# EAGLE board eightbyeight-ICN2012 (EAGLE 7.6.0)
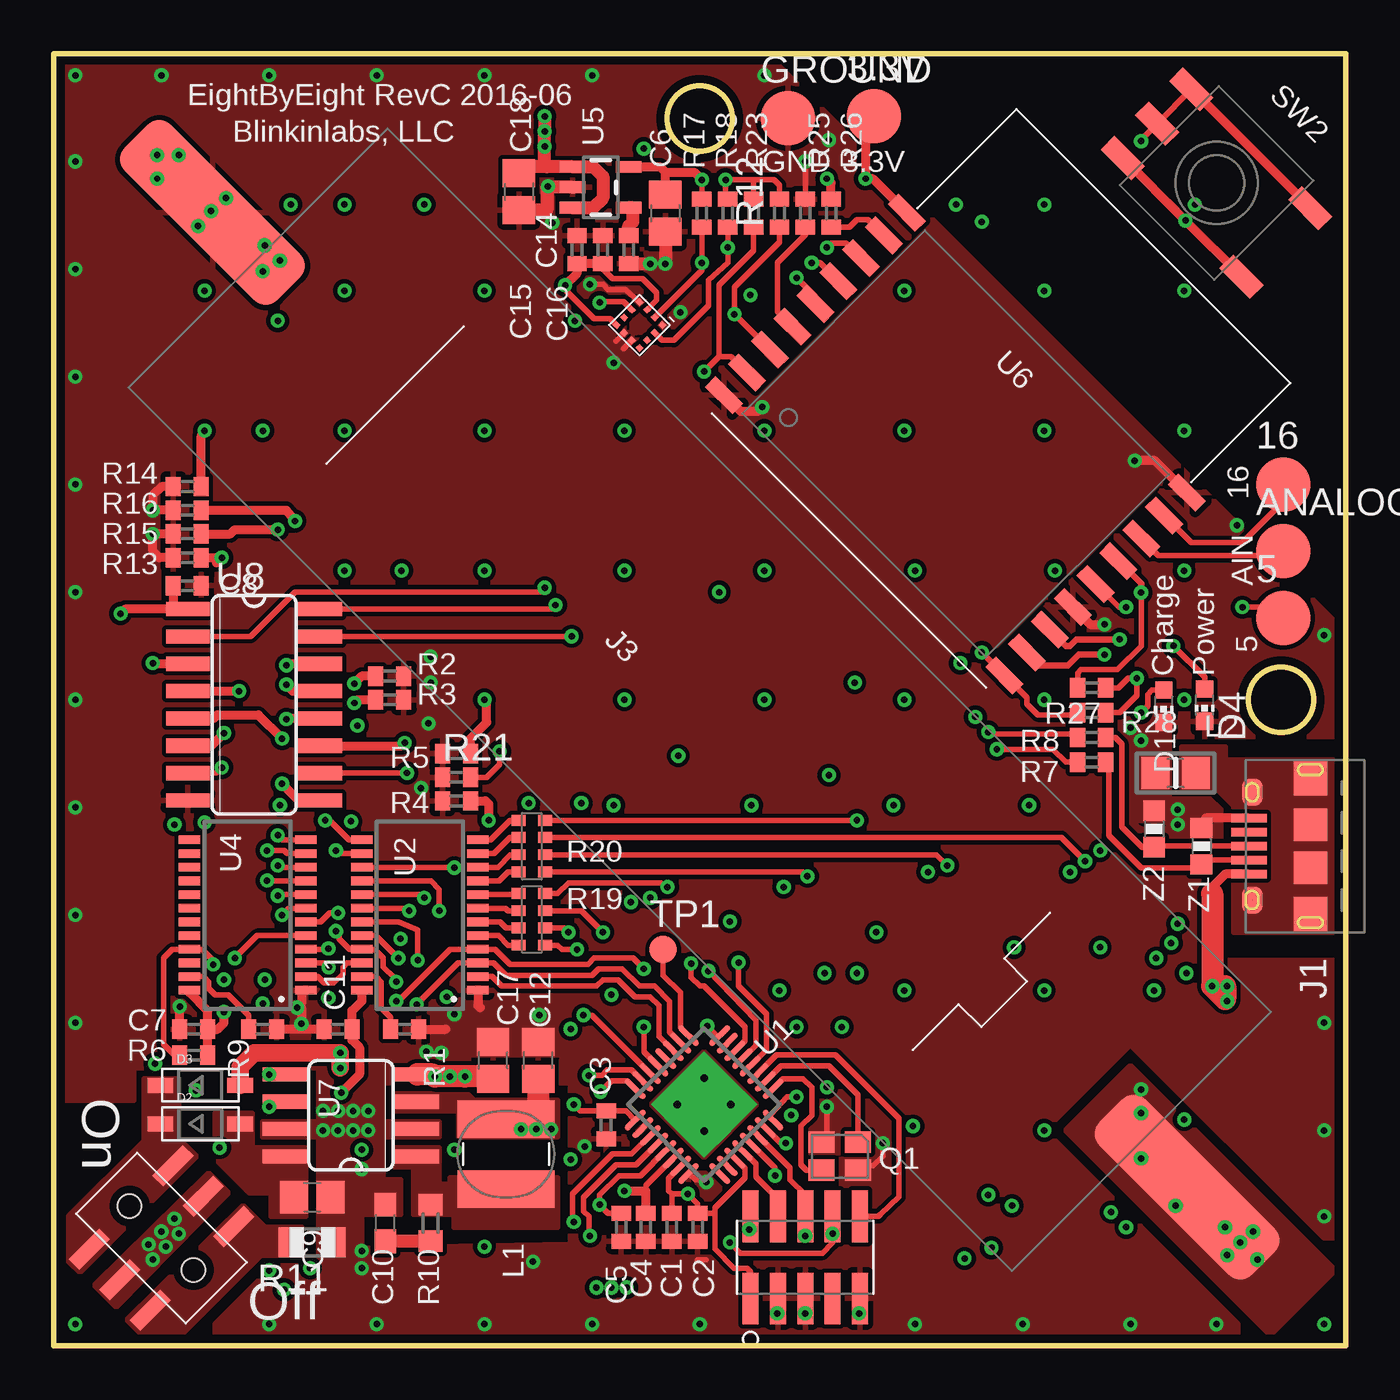
[diagram p6: board, top side]
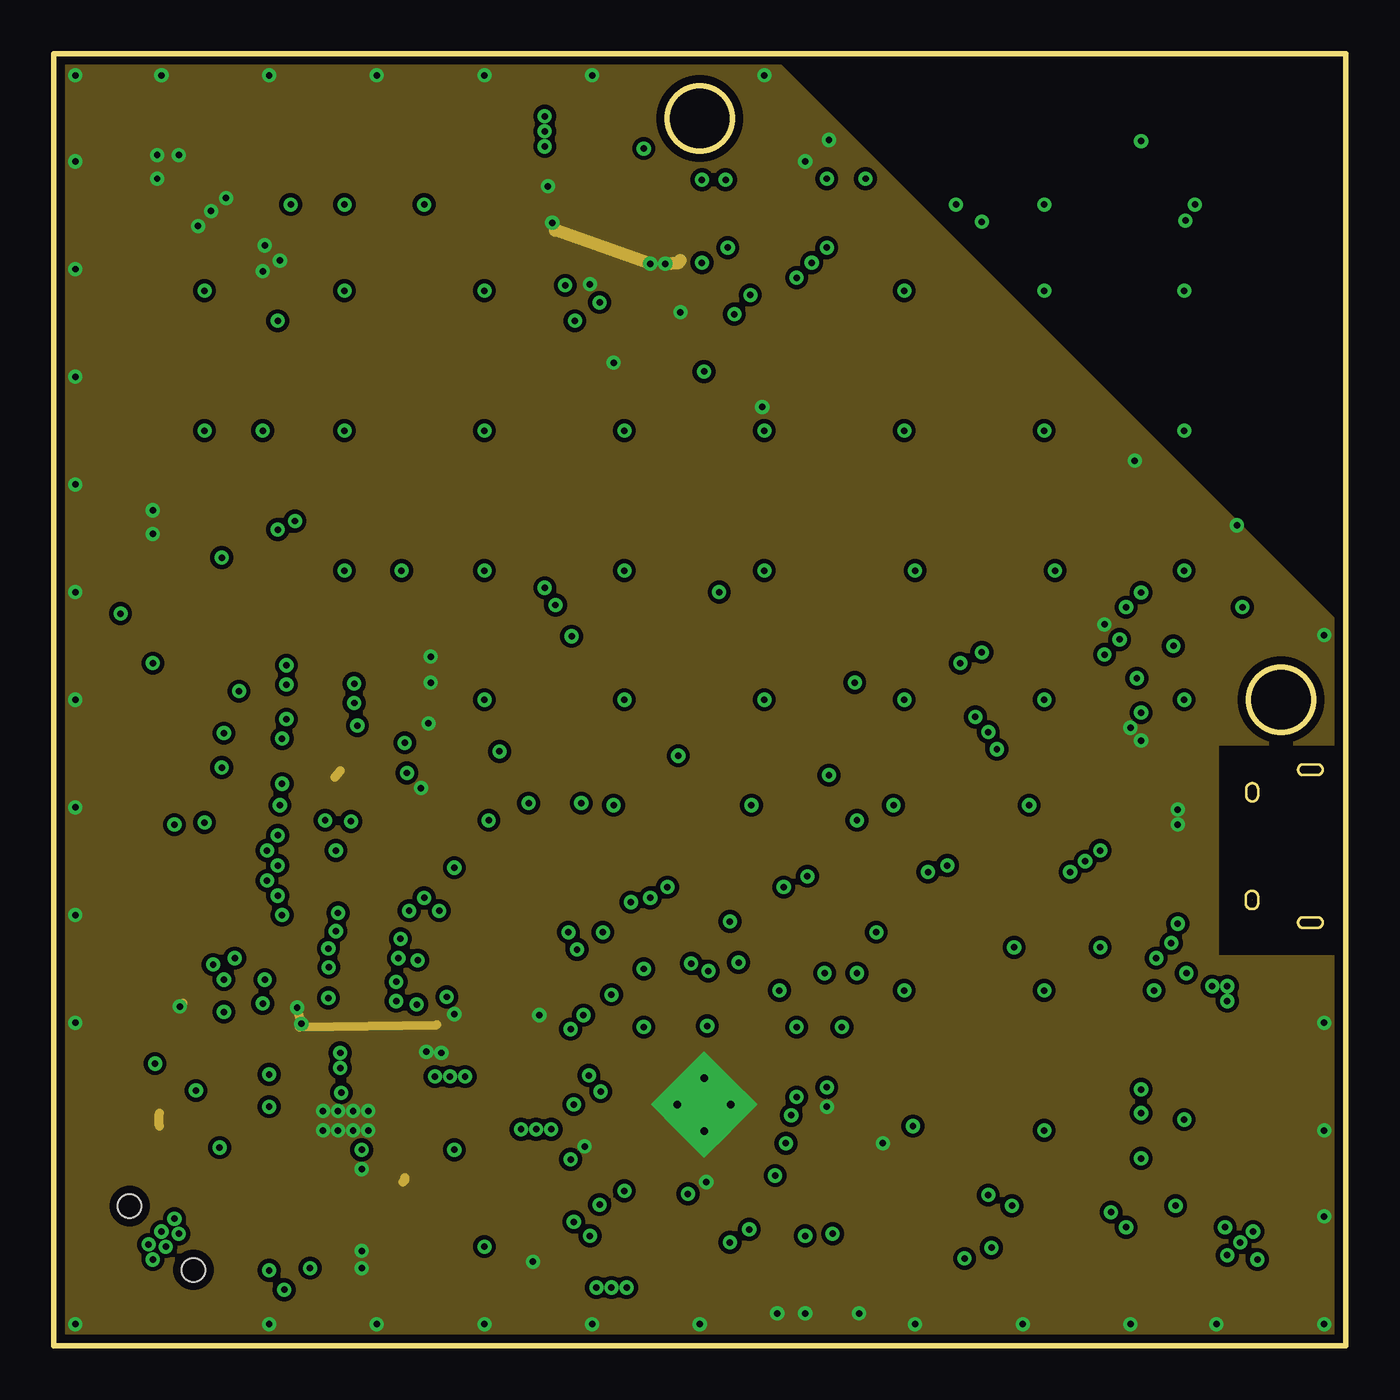
[diagram p7: board, inner layer GND]
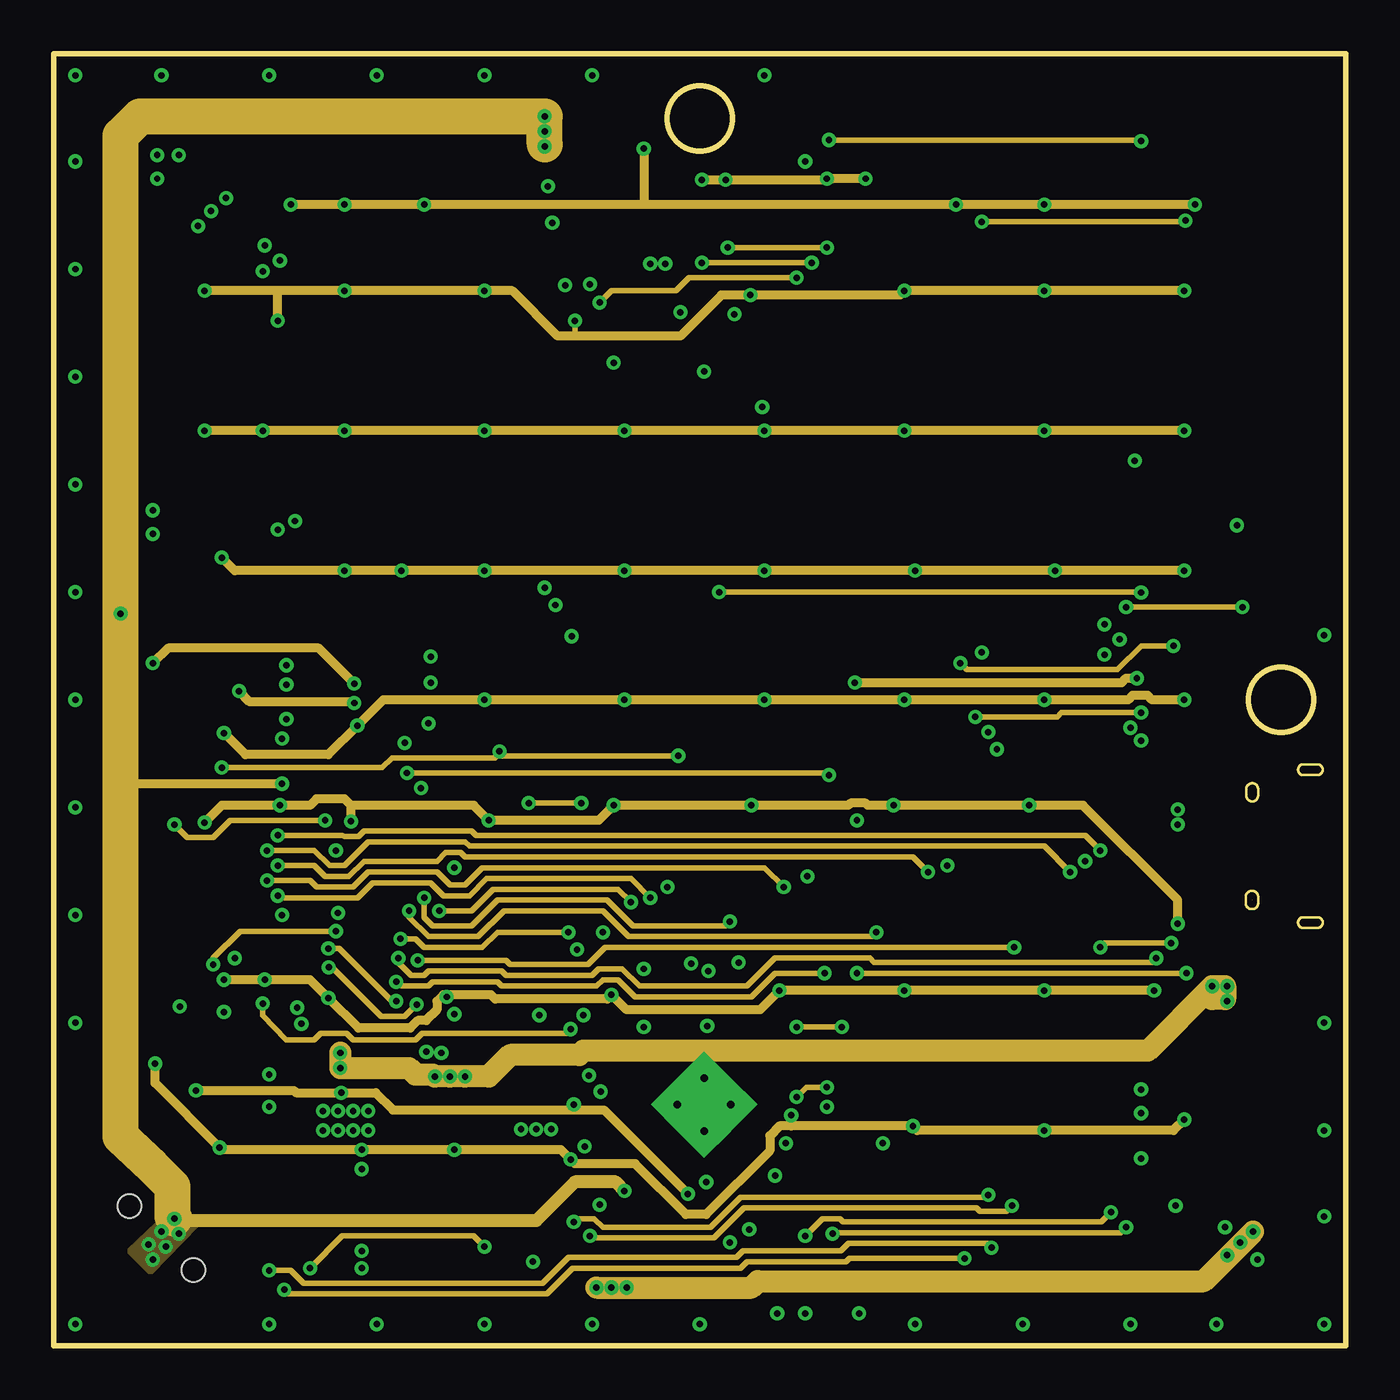
[diagram p8: board, inner layer Route]
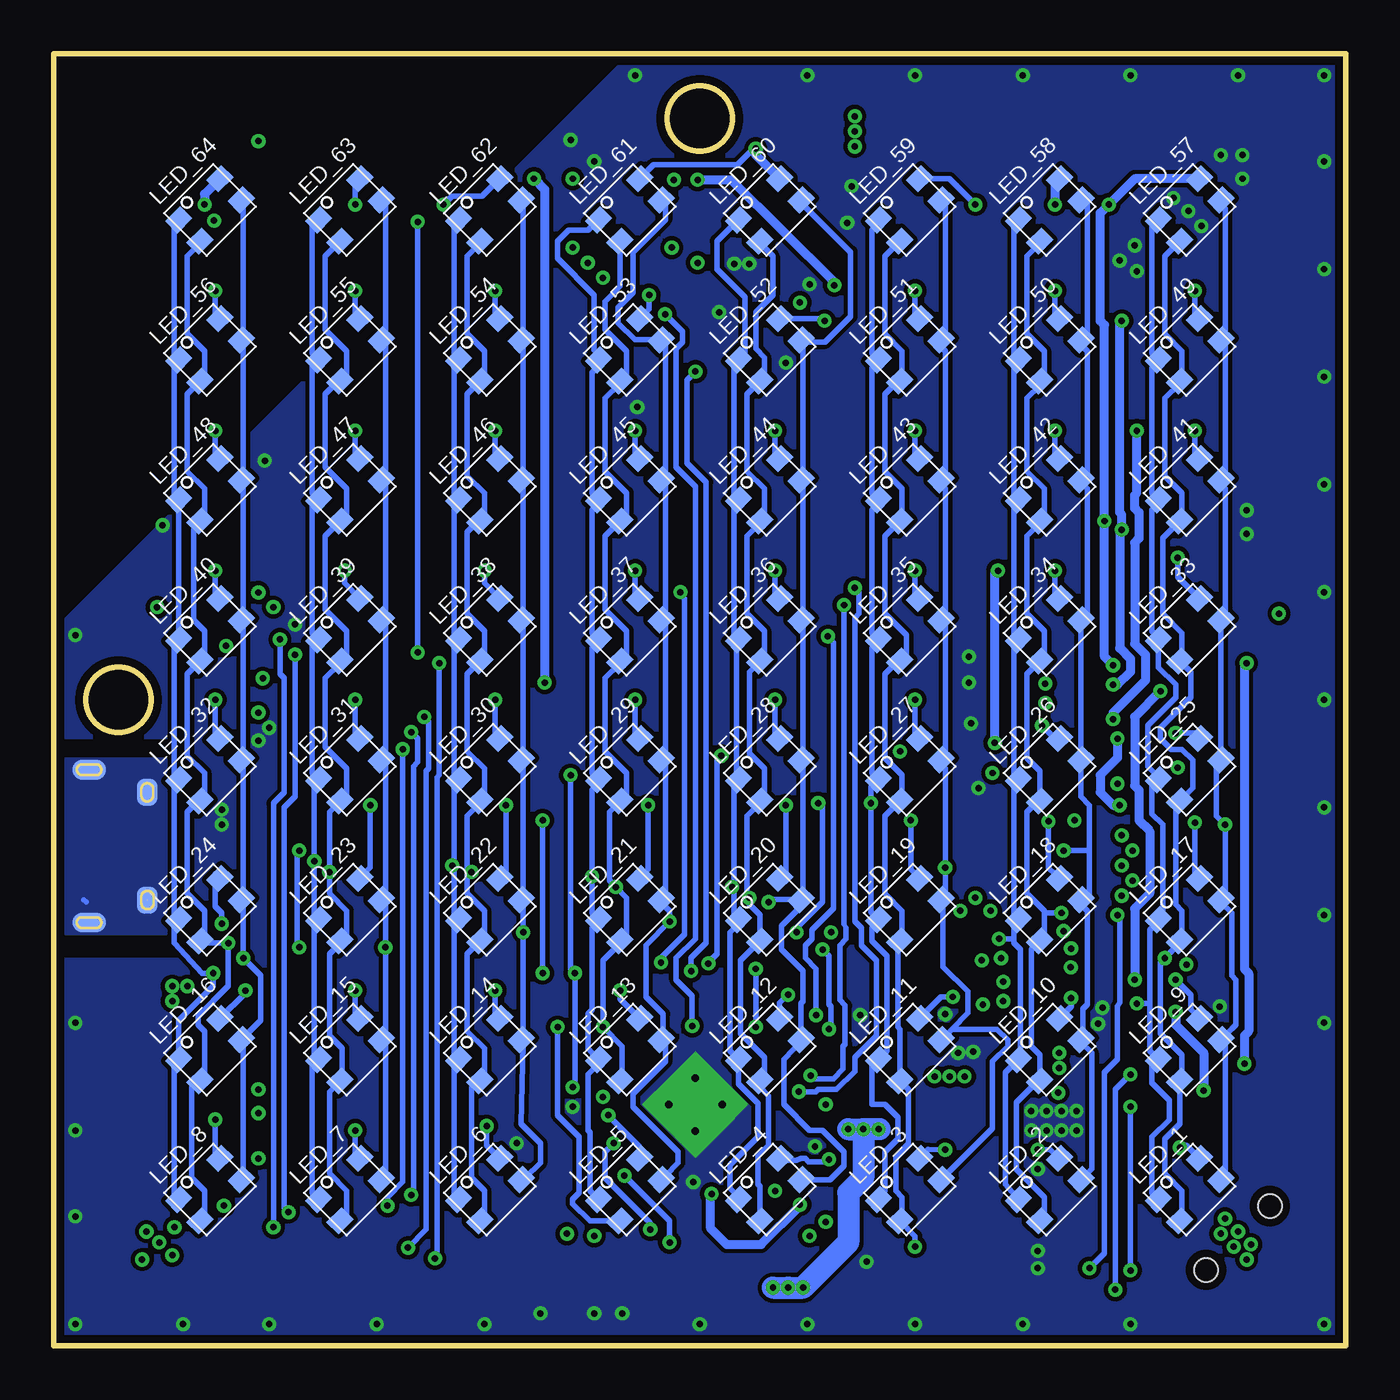
[diagram p9: board, bottom side, seen from below]

Size 60 x 60 mm. Coordinates in mm from the lower left corner, seen from the top.
Outline: 60,0 60,60 0,60 0,0 60,0
Outline: circle at 30,57 radius 1.5
Outline: circle at 57,30 radius 1.5
Copper layers (1*2+15*16): Top 0.0356mm / dielectric 0.6mm / GND 0.0356mm / dielectric 0.2mm / Route 0.0356mm / dielectric 0.6mm / Bottom 0.0356mm
Design rules "BlinkyTape *": minimum track width 0.25mm, minimum drill 0.3mm, track to track 0.2mm, track to pad 0.2mm, pad to pad 0.2mm, via to via 0.2mm, smd to smd 0.2mm, copper to edge 15mil, drill to drill 0.25mm, minimum pad ring 7mil, minimum via ring 7mil, stop-mask expansion 2mil, vias tented up to drill 0.35mm, thermal gap 10mil
Net classes: 1 power: width 0.254 mm, drill 0.35 mm
tRestrict: 8 lines

## Footprints (pad centres in the part's own frame; a part is rotated, then mirrored left to right if it is on the bottom)
B2,54 = smd 2.54 x 2.54: TP 0,0
C0402 = smd 0.7 x 0.9: 1 -0.65,0; 2 0.65,0
C0805 = smd 1.3 x 1.5: 1 -0.85,0; 2 0.85,0
C0603 = smd 1.1 x 1: 1 -0.85,0; 2 0.85,0
CHIP-LED0603 = smd 0.8 x 0.8: A 0,-0.75; C 0,0.75
SOD-123 = smd 1.2 x 0.7: A 1.85,0; C -1.85,0
USB_MICRO_THRUHOLE = smd 1.645 x 1.55: PAD$1 -3.172,0; PAD$4 3.172,0 | smd 1.5 x 1.55: PAD$2 -1,0; PAD$3 1,0 | smd 1.25 x 0.95: PAD$5 -2.5,2.7; PAD$6 2.5,2.7 | smd 0.9 x 1.55 bottom: PAD$7 -3.55,0; PAD$8 3.55,0 | smd 1.25 x 0.95 bottom: PAD$9 -2.5,2.7; PAD$10 2.5,2.7 | smd 0.4 x 1.65: PIN$1 -1.3,2.85; PIN$2 -0.65,2.85; PIN$3 0,2.85; PIN$4 0.65,2.85; PIN$5 1.3,2.85
2X05-1.27MM-SMD = smd 0.74 x 2.4: P$1 2.54,1.905; P$2 2.54,-1.905; P$3 1.27,1.905; P$4 1.27,-1.905; P$5 0,1.905; P$6 0,-1.905; P$7 -1.27,1.905; P$8 -1.27,-1.905; P$9 -2.54,1.905; P$10 -2.54,-1.905
BATTERY_AA_SMD = smd 10 x 3: + 32,0; - -32,0
INDUCTOR_CD43 = smd 1.75 x 4.5: P$1 -1.625,0; P$2 1.625,0
0805 = smd 1.3 x 1.5: 1 -0.95,0; 2 0.95,0
LED_3528 = smd 1 x 0.8: 1 -1.35,0.7; 2 1.35,0.7; 3 1.36,-0.7; 4 -1.35,-0.7
CRSYTAL_2520 = smd 1.2 x 1: P$1 -0.85,-0.65; P$2 0.85,-0.65; P$3 0.85,0.65; P$4 -0.85,0.65
R0402 = smd 0.7 x 0.9: 1 -0.65,0; 2 0.65,0
R0603 = smd 1 x 1.1: 1 -0.85,0; 2 0.85,0
R0805 = smd 1.1 x 1.4: 1 -1,0; 2 1,0
0603-ARV = smd 0.5 x 0.65: 1 -1.2,-0.625; 2 -0.4,-0.625; 3 0.4,-0.625; 4 1.2,-0.625; 5 1.2,0.625; 6 0.4,0.625; 7 -0.4,0.625; 8 -1.2,0.625
SWITCH_6P-2POS = smd 0.7 x 2: O0 -2,2.75; O1 -2,-2.75; P0 0,2.75; P1 0,-2.75; S0 2,2.75; S1 2,-2.75 | hole 1.1: -2.1,0; 2.1,0
TD-07XB = smd 2 x 0.9: 1 -3.9,-2.25; 2 3.9,-2.25; 3 -3.9,2.25; 4 3.9,2.25; 5 -3.9,0
B1,27 = smd 1.27 x 1.27: TP 0,0
QFN32_5X5_LONGLEADS = smd 1.25 x 0.275: 1 -2.775,1.75; 2 -2.775,1.25; 3 -2.775,0.75; 4 -2.775,0.25; 5 -2.775,-0.25; 6 -2.775,-0.75; 7 -2.775,-1.25; 8 -2.775,-1.75; 17 2.775,-1.75; 18 2.775,-1.25; 19 2.775,-0.75; 20 2.775,-0.25; 21 2.775,0.25; 22 2.775,0.75; 23 2.775,1.25; 24 2.775,1.75 | smd 0.275 x 1.25: 9 -1.75,-2.775; 10 -1.25,-2.775; 11 -0.75,-2.775; 12 -0.25,-2.775; 13 0.25,-2.775; 14 0.75,-2.775; 15 1.25,-2.775; 16 1.75,-2.775; 25 1.75,2.775; 26 1.25,2.775; 27 0.75,2.775; 28 0.25,2.775; 29 -0.25,2.775; 30 -0.75,2.775; 31 -1.25,2.775; 32 -1.75,2.775 | drill 0.35 pad 1.75 square: PAD@1 -0.875,0.875; PAD@4 0.875,0.875; PAD@11 0.875,-0.875 | drill 0.35 pad 1.76 square: PAD@9 -0.875,-0.875
SSOP24-150 = smd 1 x 0.4: 1 -2.7,3.493; 2 -2.7,2.857; 3 -2.7,2.223; 4 -2.7,1.587; 5 -2.7,0.953; 6 -2.7,0.318; 7 -2.7,-0.318; 8 -2.7,-0.953; 9 -2.7,-1.587; 10 -2.7,-2.223; 11 -2.7,-2.857; 12 -2.7,-3.493; 13 2.7,-3.493; 14 2.7,-2.857; 15 2.7,-2.223; 16 2.7,-1.587; 17 2.7,-0.953; 18 2.7,-0.318; 19 2.7,0.318; 20 2.7,0.953; 21 2.7,1.587; 22 2.7,2.223; 23 2.7,2.857; 24 2.7,3.493
LGA2X2MM = smd 0.275 x 0.25: 1 -0.75,-0.75; 2 -0.25,-0.75; 3 0.25,-0.75; 4 0.75,-0.75; 5 0.75,-0.25; 6 0.75,0.25; 7 0.75,0.75; 8 0.25,0.75; 9 -0.25,0.75; 10 -0.75,0.75; 11 -0.75,0.25; 12 -0.75,-0.25
SOT23-5 = smd 0.55 x 1.2: 1 -0.95,-1.3; 2 0,-1.3; 3 0.95,-1.3; 4 0.95,1.3; 5 -0.95,1.3
ESP_WROOM_02 = smd 1.8 x 0.7: 3V3 -9.2,3; EN -9.2,1.5; GND$1 -9.2,-9; GND$2 9.2,3; GND$3 9.2,-4.5; IO0 -9.2,-7.5; IO2 -9.2,-6; IO4 9.2,-9; IO5 9.2,-3; IO12 -9.2,-1.5; IO13 -9.2,-3; IO14 -9.2,0; IO15 -9.2,-4.5; IO18 9.2,1.5; RST 9.2,-1.5; RXD 9.2,-7.5; TOUT 9.2,0; TXD 9.2,-6
SO08-150 = smd 0.66 x 2.032: 1 -1.905,-3.073; 2 -0.635,-3.073; 3 0.635,-3.073; 4 1.905,-3.073; 5 1.905,3.073; 6 0.635,3.073; 7 -0.635,3.073; 8 -1.905,3.073
SO16 = smd 0.66 x 2.032: 1 -3.81,-3.073; 2 -2.54,-3.073; 3 -1.27,-3.073; 4 0,-3.073; 5 1.27,-3.073; 6 2.54,-3.073; 7 3.81,-3.073; 8 5.08,-3.073; 9 5.08,3.073; 10 3.81,3.073; 11 2.54,3.073; 12 1.27,3.073; 13 0,3.073; 14 -1.27,3.073; 15 -2.54,3.073; 16 -3.81,3.073
SPARKFUN-RESISTORS_0603-RES = smd 0.94 x 1.016: 1 -0.85,0; 2 0.85,0

## Placement (x,y rotation side)
3.3V  PTR1B2,54  [B2,54]  38.1,57.1 0 top
5  PTR1B2,54  [B2,54]  57.1,33.8 0 top
16  PTR1B2,54  [B2,54]  57.1,40 0 top
ANALOG_IN  PTR1B2,54  [B2,54]  57.1,36.9 0 top
C1  100nF  [C0402]  28.7,5.5 270 top
C2  100nF  [C0402]  29.9,5.5 270 top
C3  100nF  [C0402]  25.65,10.25 270 top
C4  100nF  [C0402]  27.5,5.5 270 top
C5  2.2uF  [C0402]  26.35,5.5 270 top
C6  20uF  [C0805]  28.4,52.6 270 top
C7  100nF  [C0402]  6.5,14.7 180 top
C8  100nF  [C0402]  6.2,35.3 0 top
C9  10uF  [C0805]  12,6.9 0 top
C10  2.2nF  [C0603]  15.4,5.7 90 top
C11  100nF  [C0402]  13.2,14.7 180 top
C12  10uF  [C0805]  22.5,13.25 90 top
C14  1uF  [C0402]  24.3,50.9 90 top
C15  100nF  [C0402]  25.5,50.9 90 top
C16  47pF  [C0402]  26.7,50.9 270 top
C17  10uF  [C0805]  20.4,13.25 90 top
C18  10uF  [C0805]  21.6,53.6 270 top
D1  BLUE  [CHIP-LED0603]  51.55,29.7 180 top
D2  RB161M-20  [SOD-123]  6.8,10.3 0 top
D3  RB161M-20  [SOD-123]  6.8,12.1 0 top
D4  BLUE  [CHIP-LED0603]  53.45,29.75 180 top
GROUND  PTR1B2,54  [B2,54]  34.1,57 0 top
J1  USB_MICROSMT+THRUHULE  [USB_MICRO_THRUHOLE]  58.36,23.2 90 top
J2  JTAG_ARM_10PIN  [2X05-1.27MM-SMD]  34.9,4.1 180 top
J3  BATTERY  [BATTERY_AA_SMD]  30,30 315 top
L1  2.2uH  [INDUCTOR_CD43]  21,8.9 270 top
L2  130ohm @100MHz  [0805]  52.1,26.6 180 top
LED_1  LED_RGB_CA  [LED_3528]  7.25,7.25 45 bottom
LED_2  LED_RGB_CA  [LED_3528]  13.75,7.25 45 bottom
LED_3  LED_RGB_CA  [LED_3528]  20.25,7.25 45 bottom
LED_4  LED_RGB_CA  [LED_3528]  26.75,7.25 45 bottom
LED_5  LED_RGB_CA  [LED_3528]  33.25,7.25 45 bottom
LED_6  LED_RGB_CA  [LED_3528]  39.75,7.25 45 bottom
LED_7  LED_RGB_CA  [LED_3528]  46.25,7.25 45 bottom
LED_8  LED_RGB_CA  [LED_3528]  52.75,7.25 45 bottom
LED_9  LED_RGB_CA  [LED_3528]  7.25,13.75 45 bottom
LED_10  LED_RGB_CA  [LED_3528]  13.75,13.75 45 bottom
LED_11  LED_RGB_CA  [LED_3528]  20.25,13.75 45 bottom
LED_12  LED_RGB_CA  [LED_3528]  26.75,13.75 45 bottom
LED_13  LED_RGB_CA  [LED_3528]  33.25,13.75 45 bottom
LED_14  LED_RGB_CA  [LED_3528]  39.75,13.75 45 bottom
LED_15  LED_RGB_CA  [LED_3528]  46.25,13.75 45 bottom
LED_16  LED_RGB_CA  [LED_3528]  52.75,13.75 45 bottom
LED_17  LED_RGB_CA  [LED_3528]  7.25,20.25 45 bottom
LED_18  LED_RGB_CA  [LED_3528]  13.75,20.25 45 bottom
LED_19  LED_RGB_CA  [LED_3528]  20.25,20.25 45 bottom
LED_20  LED_RGB_CA  [LED_3528]  26.75,20.25 45 bottom
LED_21  LED_RGB_CA  [LED_3528]  33.25,20.25 45 bottom
LED_22  LED_RGB_CA  [LED_3528]  39.75,20.25 45 bottom
LED_23  LED_RGB_CA  [LED_3528]  46.25,20.25 45 bottom
LED_24  LED_RGB_CA  [LED_3528]  52.75,20.25 45 bottom
LED_25  LED_RGB_CA  [LED_3528]  7.25,26.75 45 bottom
LED_26  LED_RGB_CA  [LED_3528]  13.75,26.75 45 bottom
LED_27  LED_RGB_CA  [LED_3528]  20.25,26.75 45 bottom
LED_28  LED_RGB_CA  [LED_3528]  26.75,26.75 45 bottom
LED_29  LED_RGB_CA  [LED_3528]  33.25,26.75 45 bottom
LED_30  LED_RGB_CA  [LED_3528]  39.75,26.75 45 bottom
LED_31  LED_RGB_CA  [LED_3528]  46.25,26.75 45 bottom
LED_32  LED_RGB_CA  [LED_3528]  52.75,26.75 45 bottom
LED_33  LED_RGB_CA  [LED_3528]  7.25,33.25 45 bottom
LED_34  LED_RGB_CA  [LED_3528]  13.75,33.25 45 bottom
LED_35  LED_RGB_CA  [LED_3528]  20.25,33.25 45 bottom
LED_36  LED_RGB_CA  [LED_3528]  26.75,33.25 45 bottom
LED_37  LED_RGB_CA  [LED_3528]  33.25,33.25 45 bottom
LED_38  LED_RGB_CA  [LED_3528]  39.75,33.25 45 bottom
LED_39  LED_RGB_CA  [LED_3528]  46.25,33.25 45 bottom
LED_40  LED_RGB_CA  [LED_3528]  52.75,33.25 45 bottom
LED_41  LED_RGB_CA  [LED_3528]  7.25,39.75 45 bottom
LED_42  LED_RGB_CA  [LED_3528]  13.75,39.75 45 bottom
LED_43  LED_RGB_CA  [LED_3528]  20.25,39.75 45 bottom
LED_44  LED_RGB_CA  [LED_3528]  26.75,39.75 45 bottom
LED_45  LED_RGB_CA  [LED_3528]  33.25,39.75 45 bottom
LED_46  LED_RGB_CA  [LED_3528]  39.75,39.75 45 bottom
LED_47  LED_RGB_CA  [LED_3528]  46.25,39.75 45 bottom
LED_48  LED_RGB_CA  [LED_3528]  52.75,39.75 45 bottom
LED_49  LED_RGB_CA  [LED_3528]  7.25,46.25 45 bottom
LED_50  LED_RGB_CA  [LED_3528]  13.75,46.25 45 bottom
LED_51  LED_RGB_CA  [LED_3528]  20.25,46.25 45 bottom
LED_52  LED_RGB_CA  [LED_3528]  26.75,46.25 45 bottom
LED_53  LED_RGB_CA  [LED_3528]  33.25,46.25 45 bottom
LED_54  LED_RGB_CA  [LED_3528]  39.75,46.25 45 bottom
LED_55  LED_RGB_CA  [LED_3528]  46.25,46.25 45 bottom
LED_56  LED_RGB_CA  [LED_3528]  52.75,46.25 45 bottom
LED_57  LED_RGB_CA  [LED_3528]  7.25,52.75 45 bottom
LED_58  LED_RGB_CA  [LED_3528]  13.75,52.75 45 bottom
LED_59  LED_RGB_CA  [LED_3528]  20.25,52.75 45 bottom
LED_60  LED_RGB_CA  [LED_3528]  26.75,52.75 45 bottom
LED_61  LED_RGB_CA  [LED_3528]  33.25,52.75 45 bottom
LED_62  LED_RGB_CA  [LED_3528]  39.75,52.75 45 bottom
LED_63  LED_RGB_CA  [LED_3528]  46.25,52.75 45 bottom
LED_64  LED_RGB_CA  [LED_3528]  52.75,52.75 45 bottom
Q1  16MHz  [CRSYTAL_2520]  36.5,8.8 180 top
R1  2k 1%  [R0402]  16.3,14.7 180 top
R2  2k  [R0402]  15.6,31.1 180 top
R3  2k  [R0402]  15.6,30 180 top
R4  2k  [R0402]  18.7,25.3 0 top
R5  2k  [R0402]  18.7,27.5 0 top
R6  10k  [R0402]  6.5,13.5 0 top
R7  33  [R0402]  48.2,27.1 180 top
R8  33  [R0402]  48.2,28.25 180 top
R9  2k 1%  [R0402]  9.7,14.7 180 top
R10  1  [R0603]  17.5,5.7 270 top
R11  50  [R0805]  12,4.8 180 top
R12  10k  [R0402]  33.7,52.6 90 top
R13  2k  [R0402]  6.2,36.6 0 top
R14  2k  [R0402]  6.2,39.9 0 top
R15  2k  [R0402]  6.2,37.7 0 top
R16  2k  [R0402]  6.2,38.8 0 top
R17  4.7k  [R0402]  30.1,52.6 90 top
R18  4.7k  [R0402]  31.3,52.6 90 top
R19  200  [0603-ARV]  22.2,19.8 270 top
R20  200  [0603-ARV]  22.2,23.2 270 top
R21  10k  [R0402]  18.7,26.4 0 top
R23  10k  [R0402]  32.5,52.6 90 top
R25  10k  [R0402]  34.9,52.6 270 top
R26  10k  [R0402]  36.1,52.6 90 top
R27  10k  [R0402]  48.2,30.55 0 top
R28  10k  [R0402]  48.2,29.4 0 top
SW1  SWITCH_SPDT  [SWITCH_6P-2POS]  5,5 135 top
SW2  BRIGHTNESS  [TD-07XB]  54,54 315 top
TP1  PTR1B1,27  [B1,27]  28.3,18.4 0 top
U1  MK20DN32VFM5  [QFN32_5X5_LONGLEADS]  30.2,11.2 45 top
U2  ICN2027  [SSOP24-150]  17,20 180 top
U3  QMA6981  [LGA2X2MM]  27.2,47.4 135 top
U4  ICN2027  [SSOP24-150]  9,20 180 top
U5  MIC5219 3.3V  [SOT23-5]  25.4,53.8 270 top
U6  ESP_WROOM_02  [ESP_WROOM_02]  44,44 315 top
U7  MP3401A  [SO08-150]  13.8,10.7 90 top
U8  ICN2012  [SO16]  9.3,30.4 270 top
Z1  PGB1010603  [SPARKFUN-RESISTORS_0603-RES]  53.3,23.2 270 top
Z2  PGB1010603  [SPARKFUN-RESISTORS_0603-RES]  51.1,24 270 top

## Tracks (layer width: path | path; a pad name or v marks a point on that pad's centre or on a via)
1ROW0  (via drill 0.3)
  Top 0.406: U8.3 4.73,31.67 v4.6,31.7 | R2.2 14.3,31.1 v13.95,30.75
  Route 0.254: v34.25,10.7 34.25,10.2
  Route 0.406: v52.5,10.5 52,10 v46,10 40.1,10 v39.9,10.2 34.25,10.2 33.7,10.2 33.25,9.75 33.25,9.05 30.3,6.1 29.35,6.1 27,8.45 24.2,8.45 v24,8.65 23.55,9.1 v18.6,9.1 v14.3,9.1 7.9,9.1 v7.7,9.2 4.7,12.2 v4.7,13.1 | v13.95,30.75 12.3,32.4 5.3,32.4 v4.6,31.7
  Bottom 0.254: LED_8.2 52.5,8.91 v52.5,10.5 | LED_7.2 46,8.91 v46,10 | LED_6.2 39.9,9.31 v39.9,10.2 | LED_3.2 19.4,9.11 v18.6,9.1 | LED_2.2 13.75,9.11 v14.3,9.1 | LED_1.2 7.4,9.31 v7.7,9.2 | 26.5,8.49 LED_4.2 | LED_5.2 32.79,9.24 v34.25,10.7 | v24,8.65 24.1,8.55 24.95,8.55 25.1,8.7 25.3,8.7 25.5,8.6 26.3,8.6 LED_4.2 | LED_4.2
  Bottom 0.406: v4.6,31.7 4.7,31.6 4.7,17.5 4.5,17.3 4.5,14.6 4.7,14.4 v4.7,13.1
1ROW1  (via drill 0.3)
  Top 0.406: U8.4 v8.6,30.4 | R3.2 14.1,30 v13.95,29.85
  Route 0.406: v51.1,16.5 v46,16.5 v39.5,16.5 v33.7,16.5 32.8,15.6 26.6,15.6 v25.9,16.3 25.7,16.1 20.5,16.1 20.3,16.3 18.4,16.3 | 18.25,16.3 v18.25,16.2 18.4,16.3 | 18.4,16.3 18.25,16.3 | 18.25,16.3 18.1,16.3 17.8,16 17.8,15.6 17.3,15.1 16.9,15.1 16.55,14.75 14.15,14.75 v12.75,16.15 11.9,17 v9.8,17 v7.9,17 | v13.95,29.85 13.9,29.9 9.1,29.9 v8.6,30.4
  Bottom 0.254: LED_15.2 46,15.41 v46,16.5 | LED_14.2 39.5,15.41 v39.5,16.5 | LED_13.2 33.7,16.11 v33.7,16.5 | LED_10.2 12.75,15.76 v12.75,16.15 | v51.1,16.5 51.1,16.39 LED_16.2 | LED_12.2 26.29,15.91 v25.9,16.3 | LED_11.2 18.79,16.2 v18.25,16.2 | v7.9,17 7.2,16.3 7.2,15.61 LED_9.2
  Bottom 0.406: v9.8,17 9.8,20.3 9.1,21 9.1,23.9 9.6,24.4 9.6,25.8 9.8,26 9.8,29.2 v8.6,30.4
1ROW2  (via drill 0.3)
  Top 0.406: R4.2 20.05,25.3 20.2,25.15 v20.2,24.4 | U8.5 7.43,29.13 7.6,29.3 9.5,29.3 v10.6,28.2
  Route 0.406: v52.2,19.6 52.2,20.7 47.8,25.1 v45.3,25.1 v39,25.1 37.8,25.1 37.7,25.2 37,25.2 36.9,25.1 v32.4,25.1 v26,25.1 25.3,24.4 v20.2,24.4 19.5,25.1 13.8,25.1 | v13.8,24.35 13.8,25.1 | 13.8,25.1 13.5,25.4 12.2,25.4 11.9,25.1 v10.5,25.1 7.8,25.1 v7,24.3
  Bottom 0.254: LED_24.2 52.5,21.91 52.5,20.4 52.2,20.1 v52.2,19.6 | LED_23.2 45.3,22.21 v45.3,25.1 | LED_22.2 39,22.01 v39,25.1 | LED_21.2 32.4,22.11 v32.4,25.1 | LED_20.2 26,22.01 v26,25.1 | LED_19.2 20.2,22.11 v20.2,24.4 | LED_18.2 13.5,21.91 13.8,22.2 v13.8,24.35 | LED_17.2 7,21.91 v7,24.3
  Bottom 0.406: v10.6,28.2 10.6,27.3 11.4,26.5 11.4,25.7 10.8,25.1 v10.5,25.1
1ROW3  (via drill 0.3)
  Top 0.406: U8.6 7.31,27.86 v7.9,28.45 | R5.2 19.35,28.2 20.1,28.95 20.1,29.9 v20,30
  Route 0.406: v52.5,30 51,30 50.8,30.2 50.1,30.2 49.9,30 v46,30 v39.5,30 v33,30 v26.5,30 v20,30 15.3,30 v14.1,28.8 12.75,27.45 8.9,27.45 v7.9,28.45
  Bottom 0.254: LED_32.2 52.5,28.41 v52.5,30 | LED_31.2 46,28.41 v46,30 | LED_30.2 39.5,28.41 v39.5,30 | LED_29.2 33,28.41 v33,30 | LED_28.2 26.5,28.41 v26.5,30 | LED_27.2 20,28.41 v20,30 | LED_25.2 7.05,28.45 v7.9,28.45 | LED_26.2 13.5,28.2 v14.1,28.8
1ROW4  (via drill 0.3)
  Top 0.406: R13.2 v7.8,36.6 7.55,36.35 | U8.11 16.16,27.86 v16.3,28
  Route 0.406: v52.5,36 v46.5,36 v40,36 v33,36 v26.5,36 v20,36 v16.15,36 v13.5,36 8.4,36 v7.8,36.6
  Bottom 0.254: LED_40.2 52.5,34.91 v52.5,36 | LED_33.2 7,34.91 7.2,35.1 7.8,35.7 v7.8,36.6 | LED_34.2 13.5,34.91 v13.5,36 | LED_35.2 20,34.91 v20,36 | LED_36.2 26.5,34.91 v26.5,36 | LED_37.2 33,34.91 v33,36 | LED_38.2 40,35.41 v40,36 | LED_39.2 46.5,35.41 v46.5,36
  Bottom 0.406: v16.3,28 16.3,35.85 v16.15,36
1ROW5  (via drill 0.3)
  Top 0.406: R14.2 6.85,42.25 v7,42.5 | U8.12 10.73,29.13 v10.8,29.1
  Route 0.406: v52.5,42.5 v46,42.5 v39.5,42.5 v33,42.5 v26.5,42.5 v20,42.5 v13.5,42.5 v9.7,42.5 v7,42.5
  Bottom 0.254: LED_48.2 52.5,41.41 v52.5,42.5 | LED_41.2 7,41.41 v7,42.5 | LED_42.2 13.5,41.41 v13.5,42.5 | LED_43.2 20,41.41 v20,42.5 | LED_44.2 26.5,41.41 v26.5,42.5 | LED_45.2 33,41.41 v33,42.5 | LED_46.2 39.5,41.41 v39.5,42.5 | LED_47.2 46,41.41 v46,42.5
  Bottom 0.406: v9.7,42.5 9.7,39.6 9.8,39.5 9.8,38.9 9.6,38.7 9.6,37.5 9.8,37.3 9.8,32.6 9.3,32.1 9.3,30.9 10.8,29.4 v10.8,29.1
1ROW6  (via drill 0.3)
  Top 0.406: R15.2 8.2,37.7 8.4,37.9 v10.4,37.9 | U8.13 11.1,30.4 v10.8,30.7
  Route 0.254: v24.2,47.6 24.2,46.9
  Route 0.406: v52.5,49 v46,49 v39.5,49 39.3,48.8 v32.35,48.8 31,48.8 29.1,46.9 24.2,46.9 23.4,46.9 21.3,49 v20,49 v13.5,49 10.4,49 | 10.4,49 v7,49 | v10.4,47.6 10.4,49
  Bottom 0.254: LED_56.2 52.5,47.91 v52.5,49 | LED_55.2 46,47.91 v46,49 | LED_54.2 39.5,47.91 v39.5,49 | LED_53.2 32.75,47.76 32.74,47.76 32.35,48.15 v32.35,48.8 | LED_51.2 20,47.91 v20,49 | LED_50.2 13.5,47.91 v13.5,49 | LED_49.2 7,47.91 v7,49 | LED_52.2 26.2,47.7 24.3,47.7 v24.2,47.6
  Bottom 0.406: v10.4,47.6 10.5,47.5 10.5,38.7 10.4,38.6 v10.4,37.9 10.5,37.8 10.5,32.4 10,31.9 10,31.3 10.6,30.7 v10.8,30.7
1ROW7  (via drill 0.3)
  Top 0.406: R16.2 10.8,38.8 v11.2,38.3 | U8.14 10.87,31.67 v10.8,31.6
  Route 0.406: v53,53 v46,53 v41.9,53 27.4,53 | v27.4,55.6 27.4,53 | 27.4,53 v17.2,53 v13.5,53 v11,53
  Bottom 0.254: LED_63.2 46,53.99 v46,53 | LED_62.2 40.1,53.39 41.5,53.4 v41.9,53 | LED_59.2 18.4,54.2 v17.2,53 | LED_61.2 32.14,54.85 28.25,54.85 27.5,55.6 v27.4,55.6
  Bottom 0.406: LED_64.2 53,53.49 v53,53 | LED_60.2 27.4,55.3 v27.4,55.6 | LED_58.2 13.5,53.99 v13.5,53 | v10.8,31.6 11.2,32 v11.2,38.3 11.2,47.4 11.4,47.6 11.4,52.6 v11,53 9.8,54.2 LED_57.2
+3V3  (via drill 0.3)
  Top 0.254: R18.2 31.2,53.35 v31.2,54.15 32.5,54.15 | R23.2 32.5,54.15 | R17.2 v30.1,54.15 | R12.2 33.7,53.9 33.45,54.15 32.5,54.15 | R27.2 49.45,30.55 49.9,31 v50.3,31 50.3,30.2 49.5,29.4 R28.2 | U3.3 28,48.55 28,48.9 27.35,49.55 25.95,49.55 25.5,50 C15.1 | U3.7 25.84,47.7 25.1,47.7 23.75,49.05 v23.75,49.25
  Top 0.406: U6.3V3 38.04,54.2 v37.7,54.2 37.7,57.1 3.3V.TP | R26.2 36.1,54 v35.9,54.2 | U5.5 28.15,54.75 28.4,54.5 | C6.1 28.4,54.5 | 28.4,54.5 29.75,54.5 v30.1,54.15 | v23.75,49.25 24.3,49.8 C14.1 C15.1
  Route 0.406: v37.7,54.2 v35.9,54.2 35.85,54.15 v31.2,54.15 v30.1,54.15 | v37.2,30.8 49.6,30.8 49.8,31 v50.3,31
  Bottom 0.406: v37.7,54.2 37.2,53.7 v37.2,30.8 | v30.1,54.15 28.55,54.15 23.75,49.4 v23.75,49.25
+5V  (via drill 0.3)
  Top 0.254: U1.6 27.5,7.44 27.5,7.19
  Top 0.406: C4.1 27.5,7.19 v26.5,7.19 | U8.1 5.7,34.21 | 5.7,34.21 3.31,34.21 v3.1,34 | C8.1 5.55,34.36 5.7,34.21 | U8.9 11.38,25.32 v10.6,26.1
  Top 0.61: 22.9,54.75 U5.1 25.05,54.75 25.5,54.3 25.5,53.3 25.05,52.85 U5.3 | 22.9,54.75 22.3,54.75 C18.1 | 22.9,54.75 22.8,54.85 v22.8,55.7 v22.8,56.4 v22.8,57.1
  Route 0.406: v10.6,26.1 3.4,26.1 3.1,26.2
  Route 0.61: v26.5,7.19 v26.5,7.2 26.1,7.6 24.2,7.6 22.4,5.8 5.7,5.8 v5.6,5.9
  Route 1.676: 22.8,55.8 v22.8,57.1 4,57.1 3.1,56.2 v3.1,34 3.1,26.2 3.1,9.7 4.6,8.3 5.5,7.4 5.5,6 v5.6,5.9
  other vias: 4.6,4 4.4,4.7 5.2,4.6 5.8,5.2 5,5.3
  pour Top (no thermals): 7.2,8 8.1,7.1 2.9,1.8 1.9,2.8
  pour Route (no thermals): 5.7,6.5 6.6,5.6 4.5,3.4 3.5,4.4
+5V_BLEED
  pour Top (no thermals): 11.5,4.2 11.5,5.5 9.8,5.5 8.8,6.5 3.4,1.2 4,0.6 6,0.6 9.6,4.2
+5V_SWITCH
  pour Top (no thermals): 1.2,3.4 6.6,8.8 5.8,9.6 5.8,12.4 4.2,12.4 4.2,9.5 0.7,6 0.7,3.9
ADC_INT1  (via drill 0.3)
  Top 0.254: v34.5,49.6 35.37,48.73 U6.IO13 | v25.35,48.45 25.4,48.5 26.45,48.5 U3.5
  Route 0.254: v34.5,49.6 29.5,49.6 28.9,49 25.9,49 v25.35,48.45
ARM_3V3  (via drill 0.3)
  Top 0.254: U1.11 32.1,8.24 32.1,7.8 30.7,6.4 30.7,6.15 | 30.7,6.15 C2.1 29.9,6.6 v29.45,7.05 28.7,7.05 | J2.P$1 32.36,3.44 32.2,3.6 31.6,3.6 30.7,4.5 30.7,6.15 | U1.1 26.58,10.9 C3.1 24.45,10.9 v24.15,11.2 | 28.7,7.05 28.55,7.2 28.55,7.78 U1.7 | C5.1 25.75,6.15 v25.35,6.55 25.35,7 26.25,7.9 27.25,7.9 U1.5 | C1.1 28.7,7.05
  Top 0.406: U4.24 6.3,16.4 7.15,15.55 C7.1 | R6.2 C7.1 | U2.24 14.3,16 13.85,15.55 C11.1 13.85,14.2 14.2,13.85 14.2,12.6 v13.35,11.75 | C7.1 7.6,14.7 7.9,15 v7.9,15.5
  Route 0.406: 24.15,10.95 15.75,10.95 14.95,11.75 v13.35,11.75 11.25,11.75 11.15,11.85 v6.6,11.85 | v24.15,11.2 24.15,10.95 | 24.15,10.95 25.55,10.95 v29.45,7.05
  Bottom 0.406: v25.35,6.55 25.35,6.5 27.15,4.7 28.75,4.7 29.5,5.45 29.5,7 v29.45,7.05 | v7.9,15.5 7.9,14.9 6.6,13.6 v6.6,11.85
ARM_BOOTLOADER
  Top 0.254: U1.25 29.1,14.78 29.1,16.4 28.3,17.2 TP1.TP
ARM_RESET
  Top 0.254: U1.19 33.56,13.5 36.3,13.5 39.24,10.56 39.24,6.91 38.4,6.1 38.3,6 J2.P$10
ARM_RX  (via drill 0.3)
  Top 0.254: J2.P$8 v36.17,5.2 36.17,4.77 35.7,4.3 31.9,4.3 v31.4,4.8 | U1.13 33.5,8.25 v33.5,7.9
  Top 0.305: U6.TXD 47.02,32.5 47.2,32.5 47.5,32.8 v49.5,32.8
  Route 0.254: v49.8,5.5 49.55,5.25 36.25,5.25 36.2,5.2 v36.17,5.2
  Bottom 0.254: v49.5,32.8 49.5,31.2 49.3,31 49.3,25.7 49.8,25.2 v49.8,5.5 | v33.5,7.9 31.4,5.8 v31.4,4.8
ARM_RX1  (via drill 0.3)
  Top 0.254: U6.IO2 v31.61,47.91 31.61,49.16 33.7,51.25 R12.1 | U1.24 30.8,14.4 v30.35,14.85
  Bottom 0.254: v31.61,47.91 30.8,47.1 30.8,46.6 31.1,46.3 31.1,40.8 30.2,39.9 30.2,18.9 31.1,18 31.1,17 30.35,16.25 v30.35,14.85
ARM_TCK
  Top 0.254: U1.12 32.6,8.45 32.6,7.85 33.4,7.05 33.4,6.24 J2.P$4
ARM_TMS  (via drill 0.3)
  Top 0.254: U1.15 33.75,9.42 v34,9.4 | v32.3,5.4 32.36,5.46 J2.P$2
  Bottom 0.254: v34,9.4 34.4,9 34.4,7.8 32.3,5.7 v32.3,5.4
ARM_TX  (via drill 0.3)
  Top 0.254: v34.9,5.1 J2.P$6 34.9,7 34.2,7.7 34.2,8.26 U1.14
  Top 0.305: U6.RXD 45.79,31.6 47.1,31.6 47.6,32.1 v48.8,32.1
  Route 0.254: v34.9,5.1 35.7,5.9 36.5,5.9 36.65,5.75 48.65,5.75 v49.1,6.2
  Bottom 0.254: v48.8,32.1 48.8,25.5 49.3,25 49.3,6.4 v49.1,6.2
BCOL0  (via drill 0.3)
  Top 0.254: U2.13 13.71,23.49 12.8,24.4 v12.6,24.4
  Route 0.254: v12.6,24.4 8.2,24.4 7.4,23.6 6.2,23.6 v5.6,24.2
  Bottom 0.254: LED_57.3 5.79,52.99 5.6,52.8 5.6,46.91 LED_49.3 5.72,46.72 5.6,46.6 5.6,40.41 LED_41.3 5.79,39.99 5.6,39.8 5.6,33.91 LED_33.3 5.79,33.59 5.8,33.5 5.8,27.31 LED_25.3 5.79,27.19 5.8,27.2 6,27 6,24.6 v5.6,24.2 5.6,20.91 LED_17.3 5.79,20.59 5.3,20.1 5.3,17.2 5.1,17 5.1,14.9 5.29,14.71 5.3,14.71 LED_9.3 5.79,14.19 5.6,14 5.6,7.91 LED_1.3
BCOL1  (via drill 0.3)
  Top 0.254: U2.14 13.21,22.86 v13.1,23
  Bottom 0.254: LED_58.3 12.29,53.09 12.2,53 12,53 12,47.01 LED_50.3 12.29,46.49 12,46.2 12,40.51 LED_42.3 12.29,40.09 12,39.8 12,34.01 LED_34.3 12.29,33.69 12.3,33.7 12.3,27.61 LED_26.3 12.29,27.09 12.3,25.5 11.9,25.1 11.9,23 | 11.9,23 11.9,21.01 LED_18.3 12.29,20.49 12,20.2 12,15.85 12.2,15.65 12.2,14.31 LED_10.3 12.29,14.09 11.8,13.6 11.8,8.21 LED_2.3 | v13.1,23 11.9,23
BCOL2  (via drill 0.3)
  Top 0.254: U2.15 18.42,22.22 v18.6,22.2
  Bottom 0.254: LED_59.3 18.79,53.19 18.6,53 18.6,46.91 LED_51.3 18.79,46.39 18.6,46.2 18.6,40.41 LED_43.3 18.79,39.99 18.6,39.8 18.6,33.91 LED_35.3 18.79,33.59 18.6,33.4 18.6,27.41 LED_27.3 18.79,26.99 18.6,26.8 v18.6,22.2 18.6,20.91 LED_19.3 18.79,20.59 18.7,20.5 18.7,17.6 17.55,16.45 17.55,15.45 18.3,14.7 | 18.3,14.7 18.69,14.31 18.7,14.31 LED_11.3 18.72,14.22 18.3,14.7 | LED_3.3 18.6,7.91 17.1,9.4 16.4,10.1 16.4,13.2 15.7,13.9 15.7,14.2 16.2,14.7 18.3,14.7
BCOL3  (via drill 0.3)
  Top 0.254: U2.16 17.51,21.59 17.9,21.2 v17.9,20.2
  Route 0.254: v17.9,20.2 19.4,20.2 20.4,21.2 26.2,21.2 v26.8,20.6
  Bottom 0.254: LED_60.3 25.29,53.09 23,50.8 23,47.8 24.18,46.62 25.19,46.62 LED_52.3 25.29,46.69 25.2,46.6 25.2,40.31 LED_44.3 25.29,40.09 25.2,40 25.2,33.81 LED_36.3 25.29,33.49 25.2,33.4 25.2,27.31 LED_28.3 25.29,27.09 25.2,27 25.2,20.81 LED_20.3 | LED_20.3 25.29,20.41 26.2,19.5 26.2,18.4 25.2,17.4 25.2,16 25.29,15.91 LED_12.3 25.22,14.22 26.1,13.3 26.1,11.2 24.9,10 24.3,10 23.3,9 23.3,8.35 23.95,7.7 25.28,7.7 LED_4.3 | LED_20.3 26.68,20.72 v26.8,20.6
BCOL4  (via drill 0.3)
  Top 0.254: U2.17 17.05,20.95 v17.2,20.8
  Route 0.254: v17.2,20.8 17.2,19.9 17.6,19.5 19.4,19.5 20.6,20.7 25.7,20.7 26.9,19.5 31.2,19.5 v31.4,19.7
  Bottom 0.254: LED_5.3 31.6,7.91 31.6,7.9 31,8.5 31,9 33.1,11.1 33.1,11.7 31.6,13.2 31.6,14 31.79,14.19 LED_13.3 31.6,14.41 31.7,14.51 31.7,15.4 32.5,16.2 32.5,18.6 v31.4,19.7 31.4,20.2 31.79,20.59 LED_21.3 31.6,20.91 31.6,27 31.79,27.19 LED_29.3 31.6,27.41 31.6,33.6 31.72,33.72 LED_37.3 31.6,33.91 31.6,40 31.79,40.19 LED_45.3 31.6,40.41 31.6,46.6 31.72,46.72 LED_53.3 33.02,46.72 33.8,47.5 33.8,48.2 33.1,48.9 33.1,50.8 31.6,52.3 31.6,53 31.79,53.19 LED_61.3
BCOL5  (via drill 0.3)
  Top 0.254: U2.18 16.38,20.32 v16.5,20.2
  Route 0.254: v16.5,20.2 16.5,19.9 17.4,19 19.7,19 20.9,20.2 25.5,20.2 26.7,19 38,19 v38.2,19.2
  Bottom 0.254: LED_62.3 38.29,53.09 38.2,53 38.2,46.81 LED_54.3 38.29,46.49 38.2,46.4 38.2,40.31 LED_46.3 38.29,40.09 38.2,40 38.2,33.81 LED_38.3 38.29,33.69 38.2,33.6 38.2,27.31 LED_30.3 38.29,27.09 38.2,27 38.2,20.81 LED_22.3 38.29,20.49 38.2,20.4 v38.2,19.2 38.2,14.31 LED_14.3 38.29,14.09 38.2,14 38.3,10.3 37.4,9.4 37.4,8.5 38.09,7.81 38.2,7.81 LED_6.3
BCOL6  (via drill 0.3)
  Top 0.254: U2.19 16.02,19.68 16.9,19.3 v16.9,17.9
  Route 0.254: v16.9,17.9 21,17.9 21.2,17.7 24.8,17.7 25.6,18.5 v44.6,18.5
  Bottom 0.254: LED_7.3 44.6,7.91 44.6,14 44.79,14.19 LED_15.3 44.6,14.41 v44.6,18.5 44.6,20.4 44.79,20.59 LED_23.3 44.6,20.91 44.6,27 44.79,27.19 LED_31.3 44.6,27.41 44.6,33.6 44.72,33.72 LED_39.3 44.6,33.91 44.6,40.2 44.62,40.22 LED_47.3 44.6,40.41 44.6,46.4 44.79,46.59 LED_55.3 44.6,46.91 44.6,53 44.79,53.19 LED_63.3
BCOL7  (via drill 0.3)
  Top 0.254: U2.20 14.95,19.05 v16,18
  Route 0.254: v16,18 16,17.8 16.6,17.2 17.2,17.2 17.4,17.4 20.8,17.4 21,17.2 25,17.2 25.3,17.5 26.4,17.5 27.2,16.7 32.2,16.7 33.5,18 37.9,18 38.1,17.8 51,17.8 v51.2,18
  Bottom 0.254: LED_64.3 51.29,53.09 51.2,53 51.2,46.81 LED_56.3 51.29,46.49 51.2,46.4 51.2,40.31 LED_48.3 51.29,40.09 51.2,40 51.2,33.81 LED_40.3 51.29,33.49 51.2,33.4 51.2,27.31 LED_32.3 51.29,27.09 51.2,27 51.2,20.81 LED_24.3 51.29,20.49 51.2,20.4 v51.2,18 50.4,17.2 50.4,15.1 51.2,14.3 51.2,14.31 LED_16.3 51.22,14.22 51.2,14.2 51.2,7.81 LED_8.3
BOOST_5V
  pour Top (no thermals): 11.7,9.2 9.2,9.2 9.2,10.8 7.5,10.8 7.5,8.7 9.1,7.1 10.1,7.1 10.1,6 11.7,6
BUTTON1  (via drill 0.3)
  Top 0.254: R28.1 47.45,29.3 45.7,29.3 45.2,29.8 45.2,30.1 44.17,31.13 U6.IO4 44.14,31.16 v43.1,32.2
  Top 0.406: SW2.1 v52.56,52.26 | 51.71,53.11 v52.56,52.26 | v52.56,52.26 SW2.2
  Route 0.254: v43.1,52.2 52.5,52.2 v52.56,52.26
  Bottom 0.254: v43.1,52.2 v43.1,32.2 43.1,32.1
CHARGE  (via drill 0.3)
  Top 0.254: U7.6 10.06,11.34 v10,11.1 | D1.A 51,30.45 50.8,30.25 50.8,29.7 v50.5,29.4
  Route 0.254: v10,3.5 11,3.5 11.6,2.9 22.7,2.9 23.9,4.1 31.7,4.1 32,4.4 36.55,4.4 36.9,4.75 43.35,4.75 v43.55,4.55 | v50.5,29.4 46.8,29.4 46.6,29.2 v42.8,29.2
  Bottom 0.254: v10,11.1 v10,3.5 | v42.8,29.2 42.6,29 42.6,26.8 42.7,26.7 42.7,5.4 v43.55,4.55
DISCHARGE  (via drill 0.3)
  Top 0.254: U7.5 v10.01,12.61 v10,12.6 | D4.A 53.45,31.05 v52,32.5
  Route 0.254: v10.7,2.6 10.9,2.4 22.9,2.4 24.1,3.6 31.9,3.6 32.2,3.9 36.8,3.9 36.95,4.05 v42.3,4.05 | v52,32.5 50.5,32.5 49.4,31.4 42.4,31.4 v42.1,31.7
  Bottom 0.254: v10,12.6 10.7,11.9 v10.7,2.6 | v42.1,31.7 42.1,26.5 42.2,26.4 42.2,4.15 v42.3,4.05
ESP_ENABLE
  Top 0.254: U6.EN 37.82,52.3 37.3,52.3 36.95,51.95 R26.1
ESP_GPIO0  (via drill 0.3)
  Top 0.254: R23.1 32.5,50.85 30.9,49.25 30.9,45.94 | U1.21 32.6,13.95 32.6,15.1 v30.4,17.4 | v30.2,45.24 30.9,45.94 | U6.IO0 31.45,45.94 30.9,45.94
  Bottom 0.254: v30.4,17.4 30.4,18 29.7,18.7 29.7,40.1 30.6,41 30.6,44.85 v30.21,45.24 v30.2,45.24
ESP_GPIO15
  Top 0.254: U6.IO15 33.6,48.04 33.6,50.3 34.9,51.6 R25.2
ESP_GPIO16
  Top 0.254: U6.IO18 52.82,37.3 55.2,37.3 57.1,39.2 16.TP 56.9,40
ESP_RESET  (via drill 0.3)
  Top 0.254: v31.8,17.8 31.8,16.7 33.1,15.4 33.1,13.75 U1.20 | R27.1 47.55,31.25 47.7,31.4 49.4,31.4 50.5,32.5 v50.5,34.98
  Top 0.305: U6.RST 50.5,35.4 v50.5,34.98
  Route 0.254: v50.5,34.98 50.5,35 v30.9,35
  Bottom 0.254: v30.9,35 30.7,34.7 30.7,19.1 31.8,18 v31.8,17.8
ESP_TOUT
  Top 0.254: U6.TOUT 51.3,36.7 56.8,36.7 57.1,37 ANALOG_IN.TP
EXP_GPIO5  (via drill 0.3)
  Top 0.254: U6.IO5 49.46,34.3 v49.8,34.3 | v55.2,34.3 56.6,34.3 5.TP
  Route 0.254: v49.8,34.3 v55.2,34.3
GCOL0  (via drill 0.3)
  Top 0.254: U4.5 9.45,19.05 v8.4,18
  Bottom 0.254: LED_57.4 8.4,50.6 8.4,47 7.6,46.2 7.6,44.91 LED_49.4 7.71,44.69 8.4,44 8.4,40.4 7.6,39.6 7.6,38.41 LED_41.4 8.5,37.5 8.5,34 7.6,33.1 7.6,31.91 LED_33.4 7.2,31.29 7.2,30.1 8.6,28.7 8.6,28.2 8.1,27.7 7.6,27.7 7.1,27.2 7.1,25.9 7.6,25.41 LED_25.4 7.9,25 7.9,20.5 7.6,20.2 7.6,18.91 LED_17.4 7.7,18.7 v8.4,18 8.6,17.8 8.6,14.5 7.6,13.5 7.6,12.41 LED_9.4 7.7,12.1 7.7,10.3 8.4,9.6 8.4,8 7.6,7.2 7.6,5.91 LED_1.4
GCOL1  (via drill 0.3)
  Top 0.254: U4.6 12.38,19.68 12.8,20.1 v13.2,20.1
  Bottom 0.254: LED_58.4 14.21,51.19 14.8,50.6 14.8,47 14,46.2 14,45.01 LED_50.4 14.21,44.59 14.8,44 14.8,40.6 14,39.8 14,38.51 LED_42.4 14.21,38.19 14.8,37.6 14.8,34 14,33.2 14,32.01 LED_34.4 14.8,31.2 14.8,27.3 14.2,26.7 14.2,25.71 LED_26.4 14.3,25.3 14.8,24.8 14.8,21 14,20.2 14,20.1 | 14,20.1 14,19.01 LED_18.4 14.6,18.4 14.6,13.9 14.2,13.5 14.2,12.71 LED_10.4 14.3,12.3 15.3,11.3 15.3,8.2 14,6.9 14,6.01 LED_2.4 | v13.2,20.1 14,20.1
GCOL2  (via drill 0.3)
  Top 0.254: U4.7 10.92,20.32 v10.6,20
  Route 0.254: v11.9,3.6 13.4,5.1 19.5,5.1 v20,4.6
  Bottom 0.254: LED_59.4 21.4,50.6 21.4,47 20.6,46.2 20.6,44.91 LED_51.4 20.8,44.8 21.4,44.2 21.4,40.6 20.6,39.8 20.6,38.41 LED_43.4 21.4,37.6 21.4,34 20.4,33 20.4,32.11 LED_35.4 20.8,31.8 21.4,31.2 21.4,27.3 20.6,26.5 20.6,25.41 LED_27.4 21.4,24.6 21.4,21 20.6,20.2 20.6,18.91 LED_19.4 20.71,18.69 20.8,18.6 20.8,14.8 20.7,14.7 LED_11.4 | 20.6,12.41 LED_11.4 | LED_11.4 20.3,11.9 20.3,9.4 20.9,8.8 20.9,7.2 20.6,6.9 20.6,5.91 LED_3.4 20,5.09 v20,4.6 | v10.6,20 10.5,19.9 10.5,15.95 10.6,15.75 10.6,13.3 11.2,12.7 11.2,4.3 v11.9,3.6
GCOL3  (via drill 0.3)
  Top 0.254: U4.8 10.45,20.95 v10.4,20.9
  Route 0.254: v10.4,20.9 10.5,20.8 14.1,20.8 14.8,21.5 17.5,21.5 18.1,20.9 19.3,20.9 20.1,21.7 26.8,21.7 v27.7,20.8
  Bottom 0.254: LED_60.4 27.21,51.19 27.2,51.2 26.6,50.6 26.6,48.8 27.4,48 27.4,46.3 27,45.9 27,45.01 | 27,45 27,45.01 | 27,45.01 LED_52.4 27.8,44.2 27.8,40.6 27,39.8 27,38.51 LED_44.4 27.21,38.19 27.8,37.6 27.8,34 27,33.2 27,32.01 LED_36.4 27.7,31.3 27.7,27.5 27,26.8 27,25.51 LED_28.4 27.21,25.19 27.8,24.6 27.8,20.9 v27.7,20.8 27.7,20.5 27.2,20 27.2,19.01 LED_20.4 28.1,17.9 28.1,14.5 27,13.4 27,12.51 LED_12.4 27.21,12.01 26.8,11.6 26.8,9.3 27.3,8.8 27.3,7.5 27.2,7.4 27.2,5.84 LED_4.4
GCOL4  (via drill 0.3)
  Top 0.254: U4.9 9.91,21.59 v9.9,21.6
  Route 0.254: v9.9,21.6 11.9,21.6 12.2,21.3 13.9,21.3 14.6,22 17.8,22 18.4,21.4 19.1,21.4 19.9,22.2 33,22.2 v33.9,21.3 | v34.5,14.8 v36.6,14.8
  Bottom 0.254: 33.7,12.2 LED_13.4 33.6,12.41 33.6,13.9 v34.5,14.8 34.5,17.9 33.71,18.69 LED_21.4 33.4,19.11 33.4,20.8 v33.9,21.3 34.2,21.6 34.2,24.8 LED_29.4 33.4,25.61 33.4,26.6 34.4,27.6 34.4,31 33.71,31.69 LED_37.4 33.4,32.11 33.4,33.2 34.4,34.2 34.4,37.6 LED_45.4 33.4,38.61 33.4,39.6 34.4,40.6 34.4,44 33.71,44.69 LED_53.4 33.4,45.11 33.4,46.2 34.4,47.2 34.4,48.5 33.7,49.2 LED_61.4 | 33.6,5.91 LED_5.4 | v36.6,14.8 36.6,10.7 35.6,9.7 35.6,7.1 35.9,6.8 35.9,6.6 35.1,5.8 LED_5.4 | LED_5.4
GCOL5  (via drill 0.3)
  Top 0.254: U4.10 10.48,22.22 v10.4,22.3
  Route 0.254: v10.4,22.3 12.1,22.3 12.6,21.8 13.7,21.8 14.4,22.5 17.8,22.5 18.2,22.9 18.9,22.9 19.1,22.7 39.9,22.7 v40.6,22
  Bottom 0.254: LED_6.4 40,6.01 40,7.2 40.6,7.8 40.6,12 40.3,12.3 LED_14.4 40,12.51 40,13.8 40.8,14.6 40.8,18.2 LED_22.4 40,19.01 40,20.2 40.8,21 40.8,22 | 40.8,22 40.8,24.6 40.21,25.19 LED_30.4 40,25.51 40,26.8 40.8,27.6 40.8,31.2 LED_38.4 40,32.01 40,33.2 40.8,34 40.8,37.8 40.3,38.3 LED_46.4 40,38.51 40,39.6 40.8,40.4 40.8,44.2 LED_54.4 40,45.01 40,46.2 40.8,47 40.8,50.6 40.21,51.19 LED_62.4 | v40.6,22 40.8,22
GCOL6  (via drill 0.3)
  Top 0.254: U4.11 10.84,22.86 10.7,23 v9.9,23
  Route 0.254: v9.9,23 12.1,23 12.8,22.3 13.5,22.3 14.6,23.4 19.1,23.4 19.3,23.2 46,23.2 v47.2,22
  Bottom 0.254: LED_7.4 46.4,6.11 46.4,7.2 47.2,8 47.2,11.8 LED_15.4 46.6,12.41 46.6,13.8 47.2,14.4 47.2,18.2 46.71,18.69 LED_23.4 46.4,19.11 46.4,20.2 47.2,21 v47.2,22 47.2,24.8 LED_31.4 46.4,25.61 46.4,26.8 47.4,27.8 47.4,31 46.71,31.69 LED_39.4 46.4,32.11 46.4,33.2 47.4,34.2 47.4,37.6 LED_47.4 46.4,38.61 46.4,39.8 47.4,40.8 47.4,44.2 46.8,44.8 LED_55.4 46.4,45.11 46.4,46.2 47.4,47.2 47.4,50.6 LED_63.4
GCOL7  (via drill 0.3)
  Top 0.254: U4.12 10.61,23.49 v10.4,23.7
  Route 0.254: v10.4,23.7 13.4,23.7 13.5,23.65 14.15,23.65 14.4,23.9 19.4,23.9 19.6,23.7 47.9,23.7 v48.6,23 | v48.6,18.5 48.8,18.7 v51.9,18.7
  Bottom 0.254: LED_8.4 53,6.01 53,7.2 53.6,7.8 53.6,12 53.3,12.3 LED_16.4 53,12.51 53,14.6 53.3,14.9 53.3,15.3 51.9,16.7 v51.9,18.7 53.11,18.7 LED_24.4 53,19.01 53,20.2 53.8,21 53.8,24.8 53.3,25.3 LED_32.4 53,25.51 53,26.6 53.8,27.4 53.8,31.2 LED_40.4 53,32.01 53,33.2 53.5,33.7 53.5,37.9 53.21,38.19 LED_48.4 53,38.51 53,39.8 53.8,40.6 53.8,44.2 LED_56.4 53,45.01 53,46.2 53.8,47 53.8,50.6 53.21,51.19 LED_64.4 | v48.6,23 48.7,22.9 48.7,18.6 v48.6,18.5
GND  (via drill 0.3)
  Top 0.254: U1.8 29.8,7.7 30.2,7.7 v30.3,7.6 | 29.9,4 30.3,4 | R25.1 v34.9,55 | Q1.P$2 35.9,9.7 v35.9,11.1 | Q1.P$4 37.55,8.35 38.05,8.35 38.5,8.8 v38.5,9.4 | J2.P$3 33.63,1.97 v33.6,1.5 | J2.P$5 v34.9,1.5 | J2.P$9 37.44,1.96 v37.4,1.5 | v50.5,55.95 50.5,56.02 SW2.5 SW2.3 | U3.8 26.1,46.65 | U3.9 26.45,46.3 | U3.4 26.56,49.05 25.75,49.05 25.5,49.3 v24.9,49.3
  Top 0.406: R15.1 v4.6,37.7 4.6,36.9 4.9,36.6 R13.1 | R16.1 v4.6,38.8 4.6,39.5 5,39.9 R14.1 | J1.PIN$5 53.5,24.5 | SW2.4 58.35,52.85 52.85,58.35 SW2.3 | U6.GND$1 31.13,44.17 31.9,43.4 32.7,43.4 v32.9,43.6 | U6.GND$2 51.14,41.1 v50.2,41.1 | U6.GND$3 48.14,33.5 v48.8,33.5 | 11.51,16.51 11.5,16.5 | R1.1 18.2,14.7 | C11.2 11.4,14.7 | 11.4,14.7 R9.1 | C7.2 v5.85,15.75 | U2.1 19.7,15.8 19.8,15.7 | 11.4,14.7 11.5,14.8 11.5,15.7 v11.3,15.7 11.5,15.9 11.5,16.51 11.51,16.51 | 11.51,16.51 U4.1
  Top 0.61: C16.2 v27.7,50.25 | C6.2 v28.4,50.25 | U5.2 22.9,53.8 22.9,52.75 C18.2
  GND 0.406: v50.2,41.1 50.3,41.1 | v48.8,33.5 48.7,33.4 | 11.4,14.8 17.8,14.9 | 4.9,10.2 4.9,10.8 | 13.3,26.7 13.05,26.4 | v11.5,14.95 v11.3,15.7 | v5.85,15.75 6,15.9 | 16.3,7.8 16.3,7.7 16.2,7.6
  GND 0.61: v27.7,50.25 23.3,51.8 | v28.4,50.25 29,50.3 29.1,50.4
  Route 0.254: v50.5,55.95 50.45,56 v36,56
  other vias: 9.8,51.1 6.7,52 9.7,49.9 7.3,52.7 52.2,24.2 52.2,24.9 50,28.7 50.5,28.1 22.25,3.9 10.5,50.4 4.8,54.2 4.8,55.3 5.8,55.3 8,53.3 13.2,10 14.6,10 13.9,10.9 13.9,10 14.6,10.9 14.3,3.6 14.3,8.2 14.3,4.4 10,1 15,1 20,1 25,1 30,1 40,1 45,1 50,1 54,1 59,6 59,10 59,15 59,33 54.95,38.1 33,59 25,59 20,59 15,59 10,59 5,59 1,59 1,55 1,50 1,45 1,40 1,35 1,30 1,25 1,20 1,15 23.15,52.15 18,13.6 24.65,9.25 59,1 1,1 17.3,13.65 22.55,15.35 18.6,15.4 13.2,10.9 12.5,10.9 12.5,10 17.5,32 17.5,30.8 17.4,28.9 17.05,25.9 29.1,48 26,45.65 22.95,53.85
  pour GND: 0,60 33.1,60 60,33.1 60,28 54,28 54,18 60,18 60,0 0,0
  pour Top (no thermals): 54.2,23.6 54.2,24.9 53.7,25.4 51.8,25.4 51.8,29.4 50.2,29.4 50.2,24.4 51.6,24.4 52.4,23.6
  pour Top (no thermals): 17.9,10.4 17.9,9.7 15.3,9.7 15.3,7.7 16.1,7.7 16.1,6.1 14.3,6.1 14.3,3.7 12.3,3.7 12.3,9.7 9.7,9.7 9.7,10.4 12.3,10.4 12.3,12.8 15.3,12.8 15.3,10.4
  pour Top (no thermals): 23.6,13.5 23.6,15.4 20.3,15.4 19.8,15.9 17.9,15.9 17.6,15.6 17.6,13.5
  pour Bottom: 0,0 60,0 60,17.9 53.9,17.9 53.9,28.3 60,28.3 60,33.1 33.1,60 0,60
  pour Top: 0,11.4 0,60 33.1,60 60,33.1 60,28.3 51.75,28.3 51.75,25.4 53.7,25.4 54.2,24.9 54.2,17.9 60,17.9 60,5 59,5 50,14 46,10 55,1 55,0 7.5,0 7.5,1 10.2,3.7 12.3,3.7 12.3,4.5 24,4.7 24,12.2 15.3,12.2 15.3,10.3 12.3,10.3 12.3,12.9 3.7,12.9 3.7,11.4
I2C_SCL  (via drill 0.3)
  Top 0.254: U6.IO14 36.8,51.2 36.1,51.2 v35.9,51 | R18.1 v31.3,51 31.3,50.3 30.4,49.5 30.4,48.3 28.8,46.7 28.25,46.7 U3.12
  Route 0.254: v35.9,51 v31.3,51
I2C_SDA  (via drill 0.3)
  Top 0.254: R17.1 v30.1,50.3 30.1,49.95 U3.2 | U6.IO12 35.58,50.3 v35.2,50.3
  Route 0.254: v35.2,50.3 v30.1,50.3
LED_CLK  (via drill 0.3)
  Top 0.254: v16.85,15.85 18.78,17.78 U2.3 20.42,17.78 21,17.2 25,17.2 25.3,17.5 26.4,17.5 27.2,16.7 27.9,16.7 28.6,16 28.6,14.57 U1.26 | v12.77,17.57 12.52,17.78 U4.3
  Route 0.254: v16.85,15.85 16.3,15.3 15.2,15.3 12.95,17.55 v12.77,17.57
LED_DAT_0
  Top 0.254: U2.2 20.36,17.14 20.8,16.7 25.2,16.7 25.5,17 26.2,17 27,16.2 27.7,16.2 28.1,15.8 28.1,14.36 U1.27
LED_DAT_1
  Top 0.254: U4.2 12.25,17.15 12.55,16.85 13,16.85 13.43,17.28 13.43,17.58 13.63,17.78 U2.22
LED_HS_EN  (via drill 0.3)
  Top 0.254: U1.22 32.1,14.16 32.1,14.8 30.2,16.7 30,16.7 29.6,17.1 v29.6,17.75 | R21.2 20.1,26.4 20.7,27 v20.7,27.6 | U8.7 7.54,26.59 v7.8,26.85
  Route 0.254: v29,27.4 20.7,27.4 | 20.7,27.4 20.6,27.4 20.5,27.3 15.7,27.3 15.25,26.85 v7.8,26.85 | v20.7,27.6 20.7,27.4
  Bottom 0.254: v29.6,17.75 29.6,17.8 29.2,18.2 29.2,27.2 v29,27.4
LED_OE  (via drill 0.3)
  Top 0.254: U1.16 33.12,10.72 33.27,10.72 33.3,10.75 34.05,11.55 v34.5,11.55 | v7.4,17.7 7.4,17.9 6.9,18.4 6.31,18.4 U4.21 6.29,18.4 5.5,18.4 5.1,18 5.1,14 5.6,13.5 R6.1 | v15.9,16.9 15.85,17.05 15.3,17.6 15.3,18 14.89,18.41 U2.21 13.74,18.41 13.25,18.9 13.25,19.1 v13.1,19.25 | U8.10 v16.39,26.59 v16.4,26.6
  Route 0.254: v35.8,17.3 33.5,17.3 32.4,16.2 27,16.2 26.2,17 25.5,17 25.2,16.7 20.8,16.7 20.6,16.9 17.6,16.9 17.4,16.7 16.15,16.7 v15.9,16.9 | v13.1,19.25 8.65,19.25 7.4,18 v7.4,17.7 | v35.9,12 34.95,12 v34.5,11.55 | v16.4,26.6 35.9,26.6 v36,26.5
  Bottom 0.254: v35.9,12 35.8,12.1 v35.8,17.3 36,17.5 v36,26.5
LED_ROW_A  (via drill 0.3)
  Top 0.254: U1.30 24.99,15.35 v24.6,15.35 | U8.15 23.86,32.94 v24.05,32.95
  Bottom 0.254: v24.05,32.95 23.8,32.65 23.8,20.3 24.8,19.3 24.8,18.9 25.1,18.6 25.1,18 24.6,17.5 v24.6,15.35
LED_ROW_B  (via drill 0.3)
  Top 0.254: U1.31 26.83,12.8 25.7,12.8 25.45,12.55 v24.85,12.55 | U8.16 23.11,34.21 v23.3,34.4
  Bottom 0.254: v23.3,34.4 23.3,19.6 23.2,19.4 23.2,18.9 23.5,18.6 23.5,16.05 23.25,15.8 23.25,14 23.35,13.9 23.35,12.85 23.8,12.4 24.7,12.4 v24.85,12.55
LED_ROW_C  (via drill 0.3)
  Top 0.254: U1.32 26.62,12.3 25.9,12.3 v25.4,11.8 | v22.8,35.2 22.6,35 11.2,35 9.14,32.94 U8.2
  Bottom 0.254: v22.8,35.2 22.6,35 22.6,34 22.8,33.8 22.8,19.7 22.5,19.4 22.5,18.6 21.8,17.9 21.8,14.4 22.8,13.4 22.8,12.75 23.65,11.9 24.5,11.9 24.6,11.8 v25.4,11.8
LED_STB  (via drill 0.3)
  Top 0.254: v27.4,17.5 26.9,18 25.1,18 24.8,17.7 21.2,17.7 20.49,18.41 U2.4 18.41,18.41 16,16 v15.9,16 | 11.71,18.4 U4.4 12.69,18.41 v12.75,18.45 | U1.29 27.4,13.65 v27.4,14.8
  Route 0.254: v15.9,16 15.7,16 13.25,18.45 v12.75,18.45
  Bottom 0.254: v27.4,17.5 v27.4,14.8
N$2
  Top 0.254: U4.23 6.96,17.14 7.2,16.9 7.2,16.6 7.5,16.3 8.1,16.3 9.05,15.35 R9.2
N$3
  pour Top (no thermals): 15.8,9.2 17.9,9.2 17.9,7.5 18.4,7.5 18.4,7.8 23.4,7.8 23.4,5.5 18.6,5.5 18.6,6.1 16.7,6.1 16.7,8.3 15.8,8.3
N$6
  Top 0.254: U1.17 33.88,12.4 34.8,12.4 35.2,12 35.2,10.7 34.7,10.2 34.7,8.4 34.95,8.15 Q1.P$3
N$7
  Top 0.61: R10.2 C10.1
N$9
  Top 0.254: J1.PIN$2 53.1,22.55 Z1.2 53.15,22.35 53,22.2 50.5,22.2 49,23.7 49,27.1 R7.1
N$10
  Top 0.254: J1.PIN$3 51.15,23.2 Z2.2 50.55,23.15 49.6,24.1 49.6,27.95 49.3,28.25 R8.1
N$15
  Top 0.61: C16.1 26.7,52 26.9,52.2 26.9,52.85 U5.4
N$18
  Top 0.254: U2.23 14.96,17.14 15.2,16.9 15.2,15.7 15.65,15.25 R1.2
N$61
  Top 0.254: U1.18 33.77,13 36,13 37.35,11.65 Q1.P$1
RCOL0  (via drill 0.3)
  Top 0.254: R19.5 23.4,18.6 23.6,18.4 v24.3,18.4
  Route 0.254: v24,14.7 23.8,14.5 17.1,14.5 16.8,14.2 13.9,14.2 13.6,14.5 12.4,14.5 12.1,14.2 10.8,14.2 9.69,15.34 v9.7,15.89
  Bottom 0.254: LED_57.1 9,52 9,46.09 LED_49.1 8.7,45.7 9,45.4 9,39.59 LED_41.1 8.7,39.1 9,38.8 9,33.2 8.7,32.9 LED_33.1 8.7,32.59 8.7,31.5 7.9,30.7 7.9,30.1 9.2,28.8 9.2,26.9 8.7,26.4 LED_25.1 9,26 9,24.7 8.5,24.2 8.5,20.1 8.7,19.9 8.7,19.89 LED_17.1 8.7,19.7 9.1,19.3 9.1,15.89 | LED_1.1 9,7.09 9,9.7 8.2,10.5 8.2,11.4 9,12.2 9,13.2 8.7,13.2 LED_9.1 9.1,13.69 9.1,15.89 | v24.3,18.4 24,18.1 24,15.85 23.9,15.75 23.9,14.8 v24,14.7 | 9.1,15.89 v9.7,15.89
RCOL0_
  Top 0.254: U2.5 20.65,19.05 21.1,18.6 R19.4
RCOL1  (via drill 0.3)
  Top 0.254: R19.6 23.7,19.4 v23.9,19.2
  Route 0.254: v23.9,19.2 20.6,19.2 19.9,18.5 17.2,18.5 16.8,18.9 v16.1,18.9
  Bottom 0.254: LED_2.1 15.8,7.49 15.8,12.7 LED_10.1 15.4,13.2 15.1,13.5 15.1,18.4 15.4,18.7 15.4,18.9 | 15.4,18.9 15.4,19.4 15.2,19.6 LED_18.1 15.4,19.99 15.4,26 15.2,26.2 LED_26.1 15.4,26.49 15.4,32.6 LED_34.1 15.4,32.99 15.4,39.2 15.31,39.29 LED_42.1 15.4,39.49 15.4,45.6 LED_50.1 15.4,45.99 15.4,52 15.2,52.2 LED_58.1 | v16.1,18.9 15.4,18.9
RCOL1_
  Top 0.254: U2.6 20.72,19.68 21,19.4 R19.3
RCOL2  (via drill 0.3)
  Top 0.254: R19.7 24.5,20.2 v25.5,19.2
  Route 0.254: v22.05,25.2 v24.5,25.2
  Bottom 0.254: LED_59.1 21.7,52.1 22,51.8 22,46.09 LED_51.1 21.7,45.7 22,45.4 22,39.59 LED_43.1 21.7,39.1 22,38.8 22,33.09 LED_35.1 21.7,32.7 22,32.4 22,26.59 LED_27.1 | LED_27.1 21.7,26.1 | LED_3.1 21.7,6.9 21.4,7.2 21.4,9 20.8,9.6 20.8,10.6 21.4,11.2 22,11.2 22,13 LED_11.1 21.3,13.69 21.3,18.1 22,18.8 22,19.4 21.7,19.7 LED_19.1 22.05,20.14 v22.05,25.2 22.05,25.94 LED_27.1 | v24.5,25.2 24.3,25 24.3,20.6 25.5,19.4 v25.5,19.2
RCOL2_
  Top 0.254: U2.7 20.98,20.32 21.1,20.2 R19.2
RCOL3  (via drill 0.3)
  Top 0.254: R19.8 23.4,21 23.9,21.5 28.2,21.5 v28.5,21.3
  Bottom 0.254: 28.4,21.3 28.4,26 28.2,26.2 LED_28.1 28.3,26.39 28.3,32.5 28.2,32.6 LED_36.1 28.4,32.99 28.4,39 28.2,39.2 LED_44.1 28.4,39.49 28.4,45.4 28.2,45.6 LED_52.1 27.9,46.1 27.9,48.7 29.2,50 29.2,51.3 | 28.4,21.3 28.4,19.99 LED_20.1 28.2,19.6 28.6,19.2 28.6,13.69 LED_12.1 28.2,12.15 27.3,11.25 27.3,9.7 28.6,8.4 28.6,7.3 28.2,6.9 LED_4.1 | LED_60.1 29.2,51.3 | 29.2,51.3 | v28.5,21.3 28.4,21.3
RCOL3_
  Top 0.254: U2.8 21.53,20.95 R19.1
RCOL4  (via drill 0.3)
  Top 0.254: R20.5 34.8,22 v35,21.8
  Bottom 0.254: LED_5.1 35.1,7.19 35.1,9.9 35.2,10 35.2,12.6 34.7,13.1 LED_13.1 35,13.59 35,13.6 35.2,13.8 35.2,15.4 35,15.6 35,19.4 34.7,19.7 LED_21.1 35,20.09 v35,21.8 35,25.8 34.7,26.1 LED_29.1 35,26.59 35,32.4 34.7,32.7 LED_37.1 35,33.09 35,38.8 34.7,39.1 LED_45.1 35,39.59 35,45.2 34.7,45.5 LED_53.1 34.7,46.05 34.9,46.25 34.9,48.8 36.6,50.5 36.6,51.3 36.1,51.8 35.19,51.8 LED_61.1
RCOL4_
  Top 0.254: U2.9 20.69,21.59 21.1,22 R20.4
RCOL5  (via drill 0.3)
  Top 0.254: R20.6 41,22.8 v41.5,22.3
  Bottom 0.254: LED_62.1 41.2,52.2 41.4,52 41.4,45.99 LED_54.1 41.4,45.6 41.4,39.49 LED_46.1 41.2,39 41.4,38.8 41.4,32.99 LED_38.1 41.4,32.6 41.4,26.49 LED_30.1 41.2,26.2 41.4,26 41.4,22.3 | 41.4,22.3 41.4,19.99 LED_22.1 41.2,19.6 41.4,19.4 41.4,13.49 LED_14.1 41.2,13.2 41.4,13 41.4,6.99 LED_6.1 | v41.5,22.3 41.4,22.3
RCOL5_
  Top 0.254: U2.10 20.62,22.22 21.2,22.8 R20.3
RCOL6  (via drill 0.3)
  Top 0.254: R20.7 46.8,23.6 v47.9,22.5
  Bottom 0.254: LED_7.1 48,7.09 48,13 LED_15.1 47.9,13.49 47.9,19.7 47.81,19.79 LED_23.1 47.9,19.99 47.9,21.8 v47.9,22.5 47.9,26.1 LED_31.1 48,26.59 48,32.6 47.81,32.79 LED_39.1 48,33.09 48,39 LED_47.1 48,39.59 48,45.6 47.8,45.6 47.7,45.7 LED_55.1 48,46.09 48,52 LED_63.1
RCOL6_
  Top 0.254: U2.11 20.46,22.86 21.2,23.6 R20.2
RCOL7  (via drill 0.3)
  Top 0.254: R20.8 v37.3,24.4
  Route 0.254: v37.3,17.3 v52.6,17.3
  Bottom 0.254: LED_64.1 54.2,52.2 54.4,52 54.4,45.99 LED_56.1 54.4,45.6 54.4,39.49 LED_48.1 54.2,39.2 54.2,39.1 54.2,32.89 LED_40.1 54.4,32.6 54.4,26.49 LED_32.1 54.2,26.2 54.4,26 54.4,19.99 LED_24.1 54.2,19.6 54.4,19.4 54.4,18.7 53.1,17.3 v52.6,17.3 52.6,16.7 54.2,15.1 LED_16.1 54.29,13.2 54.4,13.2 54.4,6.99 LED_8.1 | v37.3,24.4 v37.3,17.3
RCOL7_
  Top 0.254: U2.12 20.29,23.49 21.2,24.4 R20.1
SHIELD  (1 unrouted)
  Bottom 0.254: 58.6,20.7 58.5,20.6
  pour Top (no thermals): 60,19.2 54.8,19.2 54.8,25.1 54,25.9 52.4,25.9 52.4,27.8 54.4,27.8 54.4,27.2 60,27.2
  pour Bottom (no thermals): 60,19.2 54.8,19.2 54.8,27.2 60,27.2
USB_5V  (via drill 0.3)
  Top 0.406: J1.PIN$1 54.4,21.9 53.8,21.3 53.8,21 | 54.4,16.1 v54.5,16 | v54.5,16.7 v53.8,16.7
  Top 0.813: D3.A 8.65,12.95 9.3,13.6 v13.3,13.6 v13.3,12.9
  Top 1.016: 53.8,21 v53.8,16.7 | v53.8,16.7 54.4,16.7 54.4,16.1 v53.8,16.7 | U7.4 17.6,12.6 v17.7,12.5 v19.1,12.5 20.3,12.5 C17.1
  Route 1.016: v53.8,16.7 54.4,16.7 54.4,16.1 53.8,16.1 v53.8,16.7 | v53.8,16.7 50.8,13.7 24.6,13.7 24.4,13.5 21.2,13.5 20.2,12.5 v19.1,12.5 v18.4,12.5 v17.7,12.5 17.6,12.6 16.8,12.6 16.5,12.9 v13.3,12.9 v13.3,13.6
USB_D+  (via drill 0.3)
  Top 0.254: R8.2 47.55,28.4 43.5,28.4 v43.4,28.5 | U1.3 26.84,8.9 25.95,8.9 24.1,7.05 24.1,5.8 v24.15,5.75
  Route 0.254: v43.4,7 43.3,6.9 31.9,6.9 30.5,5.5 25.5,5.5 25.1,5.9 24.3,5.9 v24.15,5.75
  Bottom 0.254: v43.4,28.5 43.1,28.2 43.1,27.1 43.3,26.9 43.3,7.1 v43.4,7
USB_D-  (via drill 0.3)
  Top 0.254: v43.8,27.7 46.4,27.7 47,27.1 R7.2 | U1.4 27.05,8.4 26.1,8.4 24.6,6.9 24.6,6.25 24.85,6 24.85,5.15 v24.9,5.1
  Route 0.254: v24.9,5.1 25,5 30.65,5 32.05,6.4 42.85,6.4 43,6.25 44.25,6.25 v44.5,6.5
  Bottom 0.254: v44.5,6.5 44.5,6.9 43.8,7.6 v43.8,27.7
VBAT  (via drill 0.3)
  Top 1.016: C12.1 22.5,10.9
  Route 1.016: v25.2,2.7 32.4,2.7 32.7,3 53.4,3 v55.7,5.3
  Bottom 1.016: 21.65,10.05 v22.4,10.05 | v23.1,10.05 v22.4,10.05 | v22.4,10.05 22.4,7.8 23.1,7.1 23.1,4.8 v25.2,2.7 v26.6,2.7 v25.9,2.7
  other vias: 50.5,10.8 50.5,8.7 52.1,6.5 55.1,4.8 54.4,5.5 54.5,4.2 55.9,4 21.7,10.05 50.5,11.9
  pour Top (no thermals): 50,13 59.5,3.5 56.5,0.5 47,10
  pour Top (no thermals): 15.9,11.7 19.2,11.7 19.5,11.4 23.4,11.4 23.4,9.7 18.8,9.7 18.8,10.9 15.9,10.9

## Text on the board
tPlace: EightByEight RevC 2016-06 | Blinkinlabs, LLC | GND | 3.3V | 16 | AIN | 5 | Charge | Power | On | Off